# Altium schematic sheet BreakoutBoard.SchDoc
size B
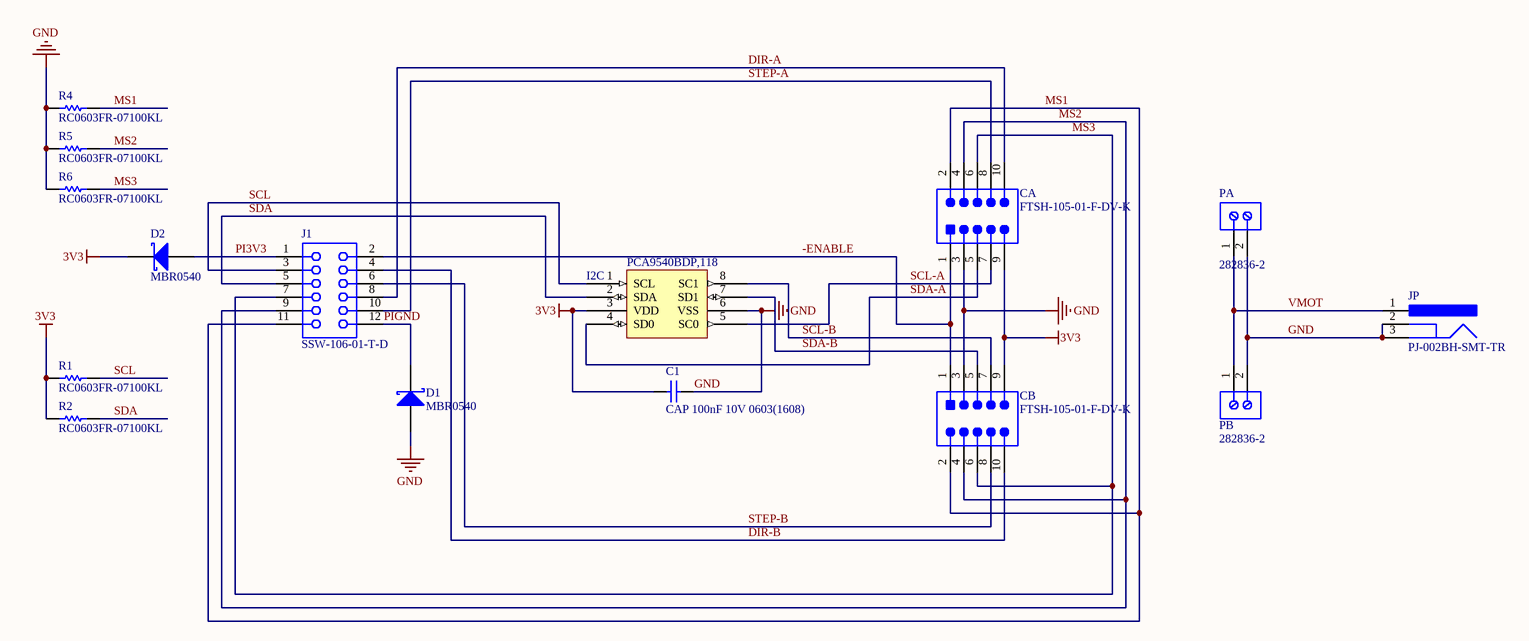
[diagram p0: BreakoutBoard.SchDoc]

## Parts
C1  CAP 100nF 10V 0603(1608)  [CAPC0603(1608)100_M]
CA  FTSH-105-01-F-DV-K  [SMTC-FTSH-105-01-L-DV-K_V]
CB  FTSH-105-01-F-DV-K  [SMTC-FTSH-105-01-L-DV-K_V]
D1  MBR0540  [FAIR-SOD123-2_V]
D2  MBR0540  [FAIR-SOD123-2_V]
I2C  PCA9540BDP,118  [TSOP65P490X110-8N]
J1  SSW-106-01-T-D  [SMTC-SSW-106-01-X-D]
JP  PJ-002BH-SMT-TR  [CUI-PJ-002BH-SMT_V]
PA  282836-2  [TECO-282836-2_V]
PB  282836-2  [TECO-282836-2_V]
R1  RC0603FR-07100KL  [RESC1608X55X25ML10T15]
R2  RC0603FR-07100KL  [RESC1608X55X25ML10T15]
R4  RC0603FR-07100KL  [RESC1608X55X25ML10T15]
R5  RC0603FR-07100KL  [RESC1608X55X25ML10T15]
R6  RC0603FR-07100KL  [RESC1608X55X25ML10T15]

## Nets
3V3: C1.1 CA.9 CB.9 D2.2(K) I2C.3(VDD) R1.1 R2.1
GND: C1.2 CA.3 CB.3 D1.1(A) I2C.6(VSS) JP.2 JP.3 PA.2 PB.2 R4.1 R5.1 R6.1
-ENABLE: CA.1 CB.1 J1.2
DIR-A: CA.10 J1.8
DIR-B: CB.10 J1.4
MS1: CA.2 CB.2 J1.11 R4.2
MS2: CA.4 CB.4 J1.9 R5.2
MS3: CA.6 CB.6 J1.7 R6.2
PI3V3: D2.1(A) J1.1
PIGND: D1.2(K) J1.12
SCL: I2C.1(SCL) J1.3 R1.2
SCL-A: CA.7 I2C.5(SC0)
SCL-B: CB.7 I2C.8(SC1)
SDA: I2C.2(SDA) J1.5 R2.2
SDA-A: CA.5 I2C.4(SD0)
SDA-B: CB.5 I2C.7(SD1)
STEP-A: CA.8 J1.10
STEP-B: CB.8 J1.6
VMOT: JP.1 PA.1 PB.1

## Notes on the sheet
- THIS DOCUMENT CONTAINS PROPRIETARY INFORMATION AND IS NOT TO BE DISCLOSED OR USED WITHOUT THE DIRECT WRITTEN CONSENT OF BRESSLERGROUP
- CHECKED:
- DRAWN:
- DATE:
- BRESSLER
- group
- 2400 Market St., Suite 1-2
- Philadelphia, Pennsylvania
- 215.561.5100  Voice
- 215.561.5101  Fax
- CLIENT/JOB:
- APPROVED:
- 19103
- USA
- www.bresslergroup.com
- TITLE:
- PART NO.
- DWG NO.
- SHT
- OF
- REV.
- DATE
- BY
- DESCRIPTION

## Library data of the parts
C1 = CMP-1035-02580-1: CAP 100nF 10V ±10% 0603 (1608 Metric) Thickness 1mm SMD; Tolerance: Â±10%; Case-EIA: 0603; Case-Metric: 1608; Max Thickness: 1 mm; Value: 100nF; Rated Voltage: 10 V; Technology: SMT
CA CB = CMP-2000-05352-1: Male Header, Pitch 1.27 mm, 2 x 5 Position, Height 6.12 mm, RoHS, Tube; Manufacturer: Samtec; Number of Positions: 10; Connector Type: Header,Shrouded; Number of Positions Loaded: All; Row Spacing: 0.050"(1.27mm); System: Connector; Fastening Type: -; Package Reference: FTSH-105-01-L-DV-K; Termination: Solder; Package URL: http://suddendocs.samtec.com/prints/ftsh-1xx-xx-xxx-dv-xxx-footprint.pdf; Number of Rows: 2; Contact Finish Thickness: 3µin(0.08µm); Contact Type: MalePin; Manufacturer URL: http://www.samtec.com/; Contact Mating Length: 0.120"(3.05mm); Pitch: 0.050"(1.27mm); Series: FTSH; Features: -; Contact Finish: Gold; Color: Black; Family: RectangularConnectors-Headers,MalePins; Datasheet URL: http://suddendocs.samtec.com/prints/ftsh-1xx-xx-xxx-dv-xxx-mkt.pdf; Package Description: Male Header, Pitch 1.27 mm, 2 x 5 Position, Height 5.97 mm, Tail Length 4.32 mm; Mounting Type: SurfaceMount; Datasheet Version: Rev. ET, 10/1995; Category: Connectors,Interconnects; Packaging: Tube
D1 D2 = CMP-2000-05114-1: Schottky Rectifier, 40 V, 0.5 A, 2-Pin SOD-123, RoHS, Tape and Reel; Manufacturer: Fairchild; Speed: FastRecovery=200mA(Io); Voltage - DC Reverse (Vr) (Max): 40V; Online Catalog: SchottkyDiode; Voltage - Forward (Vf) (Max) @ If: 510mV@500mA; Current - Reverse Leakage @ Vr: 20µA@40V; Current - Average Rectified (Io): 500mA; Other Names: MBR0540CT; Series: -; Category: DiscreteSemiconductorProducts; Datasheet URL: https://datasheet.ciiva.com/8303/mbr0540-8303808.pdf; Operating Temperature - Junction: -65degC~125degC; Manufacturer URL: https://www.fairchildsemi.com/; Family: Diodes,Rectifiers-Single; Mounting Type: SurfaceMount; Standard Package: 1; Diode Type: Schottky; Supplier Device Package: SOD-123; Reverse Recovery Time (trr): -; Package / Case: SOD-123; Datasheet Version: Rev. 1.1.0, 10/2014; Capacitance @ Vr, F: -; Packaging: CutTape(CT)
I2C = CMP-00893-4: IC I2C MUX 2CH 8-TSSOP; Logic Function: Multiplexer; Max Frequency: 400kHz; Max Power Dissipation: 400mW; Max Supply Voltage: 5.5V; Min Supply Voltage: 2.3V; Nominal Supply Current: 100mA; Number of Channels: 2; Number of Input Lines: 1; On-State Resistance: 55R; Propagation Delay: 0.3ns; Quiescent Current: 65uA; Case/Package: TSSOP; Contact Plating: Gold; Height: 0.95mm; Interface: I2C; Lead Free: Lead Free; Length: 3.1mm; Max Operating Temperature: 85°C; Min Operating Temperature: -40°C; Mount: Surface Mount; Number of Circuits: 2; Number of Inputs: 2; Number of Output Lines: 2; Number of Outputs: 1; Number of Pins: 8; Package Quantity: 1; Packaging: Tape and Reel; Power Dissipation: 400mW; Radiation Hardening: No; Width: 3.1mm
J1 = CMP-1023-00356-1: SQ Post Socket, Through-hole, Vertical, -55 to 105 degC, 2.54mm Pitch, 12-Pin, Female, RoHS; Manufacturer: Samtec; ComponentLink1Description: Manufacturer URL; RoHS: True; Mounting Technology: Through-hole; ComponentLink1URL: http://www.samtec.com; PackageVersion: CA, 6/1987; DatasheetVersion: F-214; PackageReference: SSW-106-01-X-D; Temperature Range: -55 to 105 degC; PartNumber: SSW-106-01-T-D; ComponentLink3URL: http://www.samtec.com/documents/webfiles/cpdf/SSW-1XX-XX-XXX-X-XX-XXX-XX-MKT.pdf; ComponentLink2URL: http://www.samtec.com/documents/webfiles/pdf/SSW_TH.PDF; Pitch: 2.54 mm; Orientation: Vertical; ComponentLink3Description: Package Specification; ComponentLink2Description: Datasheet; PackageDescription: Assembly, Socket Strip .016 X .031 Tail
JP = CMP-2000-06897-1: DC Power Jack, 24 V, -25 to 85 degC, 3-Pin SMD, RoHS, Bulk; Manufacturer: CUIInc.; Brand: CUI; Insulation Resistance: 100MOhms; Inside Contact Diameter: 2.5mm; Outside Contact Diameter: 6.5mm; Voltage Rating: 24V; Current Rating: 5A; Mounting Angle: Right; Mounting Technology: SurfaceMount; Package Reference: PJ-002BH-SMT; Contact Gender: Male; Housing Material: Polyamide(PA); RoHS: True; Product: Jacks; Operating Temperature Range: -25Cto+85C; Mounting Style: SMD/SMT; Factory Pack Quantity: 350; Product Category: DCPowerConnectors; Datasheet URL: http://www.cui.com/product/resource/pj-002bh-smt.pdf; Packaging: Reel; Manufacturer URL: http://www.cui.com/; Datasheet Version: Rev. 1.05, 05/2016; Contact Plating: Nickel; Package Description: 3-Pin Surface Mount Device, Body 9 x 14.8 mm, Pitch 6.1 mm; Contact Material: Brass; Connector Type: DCPowerJack; Termination Style: SMD/SMT; Flammability Rating: UL94V-0
PA PB = CMP-1684-00017-1: Female Header, Pitch 5 mm, 1 x 2 Position, Height 10 mm, Tail Length 3.5 mm, Rohs, Bulk; Manufacturer: TE Connectivity; Wire Gauge: 16-30AWG; Product Training Modules: Wire-to-BoardEurostyleTerminalBlocks; Clamp Material - Plating: Brass-NickelPlated; Voltage: 300V; Mating Orientation: HorizontalwithBoard; Current: 13.5A; Pitch: 0.197"(5.00mm); Screw Thread: M3; 3D Model: 282836-2.pdf; Other Names: 5ULV-02B / A98076; Dynamic Catalog: BuchananSeries; Number of Levels: 1; Torque - Screw: 0.68Nm(6Lb-In); Featured Product: EurostyleTerminalBlockConnectors; Positions Per Level: 2; Wire Termination: Screw-RisingCageClamp; System: Connector; Datasheet URL: http://www.te.com.cn/commerce/DocumentDelivery/DDEController?Action=showdoc&DocId=Catalog+Section%7F1308389_EUROSTYLE_TERMINAL_BLOCKS%7F0607%7Fpdf%7FEnglish%7FENG_CS_1308389_EUROSTYLE_TERMINAL_BLOCKS_0607.pdf%7F282836-2; Color: Green; Family: TerminalBlocks-WiretoBoard; RoHS Information: 282836-2StatementofCompliance; Standard Package: 300; Contact Material - Plating: Brass-TinPlated; Manufacturer URL: http://www.te.com; Housing Material: Polyamide(PA66),Nylon6/6; Features: Interlocking(Side); Package Description: Female Header, Pitch 5 mm, 1 x 2 Position, Height 10 mm, Tail Length 3.5 mm; Mounting Type: ThroughHole; Package Reference: THD; Packaging: Bulk; Series: Buchanan; Category: Connectors,Interconnects; Screw Material - Plating: Brass-NickelPlated
R1 R2 R4-R6 = CMP-2100-03662-1: Chip Resistor, 100 KOhm, +/- 1%, 0.1 W, -55 to 155 degC, 0603 (1608 Metric), RoHS, Tape and Reel; Manufacturer: Yageo; Power Rating: 100mW; Voltage Rating: 50V; Temperature Coefficient: 100ppm/degreesC; Datasheet Version: Rev. 5, 10/2016; Height: 0.45mm; Lead Free: LeadFree; Manufacturer URL: http://www.yageo.com/; Package Reference: 0603; Depth: 0.8mm; RoHSCompliant: true; Composition: ThickFilm; Military Standard: Not; Resistance: 100KOhm; Case/Package: 0603; Packaging: TapeandReel; Case Code (Imperial): 0603; Voltage Rating (DC): 50V; Case Code (Metric): 1608; Tolerance: 1%; Termination: SMD/SMT; Min Operating Temperature: -55degC; Number of Pins: 2; Length: 1.6mm; Width: 0.8mm; Datasheet URL: http://www.yageo.com/NewPortal/yageodocoutput?fileName=/pdf/R-Chip/PYu-RC_Group_51_RoHS_L_5.pdf; Package Description: 2-Pin Surface Mount Device, Body 1.6 x 0.8 mm; Max Operating Temperature: 155degC; REACH SVHC: NoSVHC